# Altium project 28Pins_Project_V1I1.PrjPcb
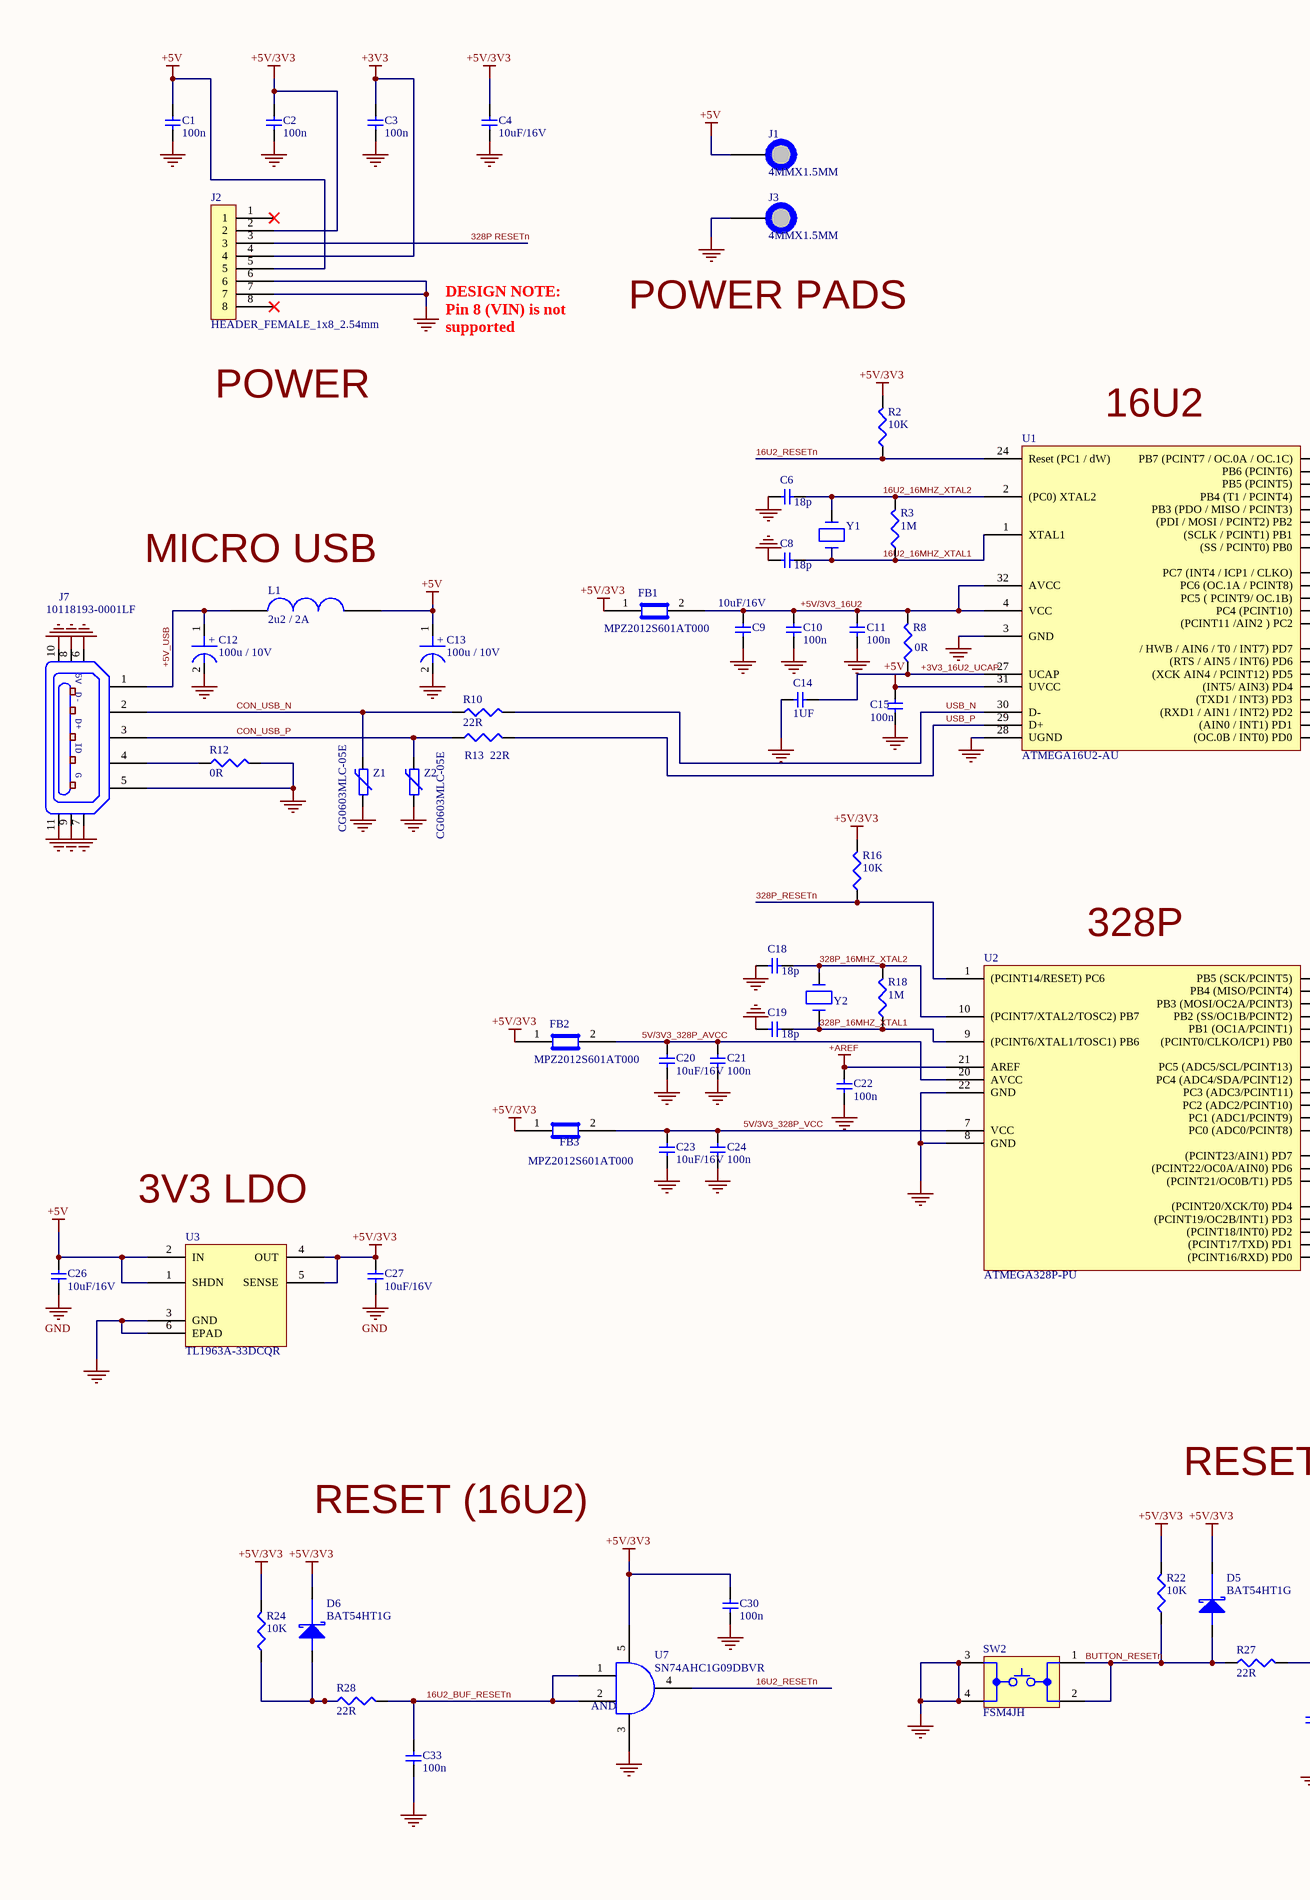
[diagram p0: 28Pins_Schematic.SchDoc, left]
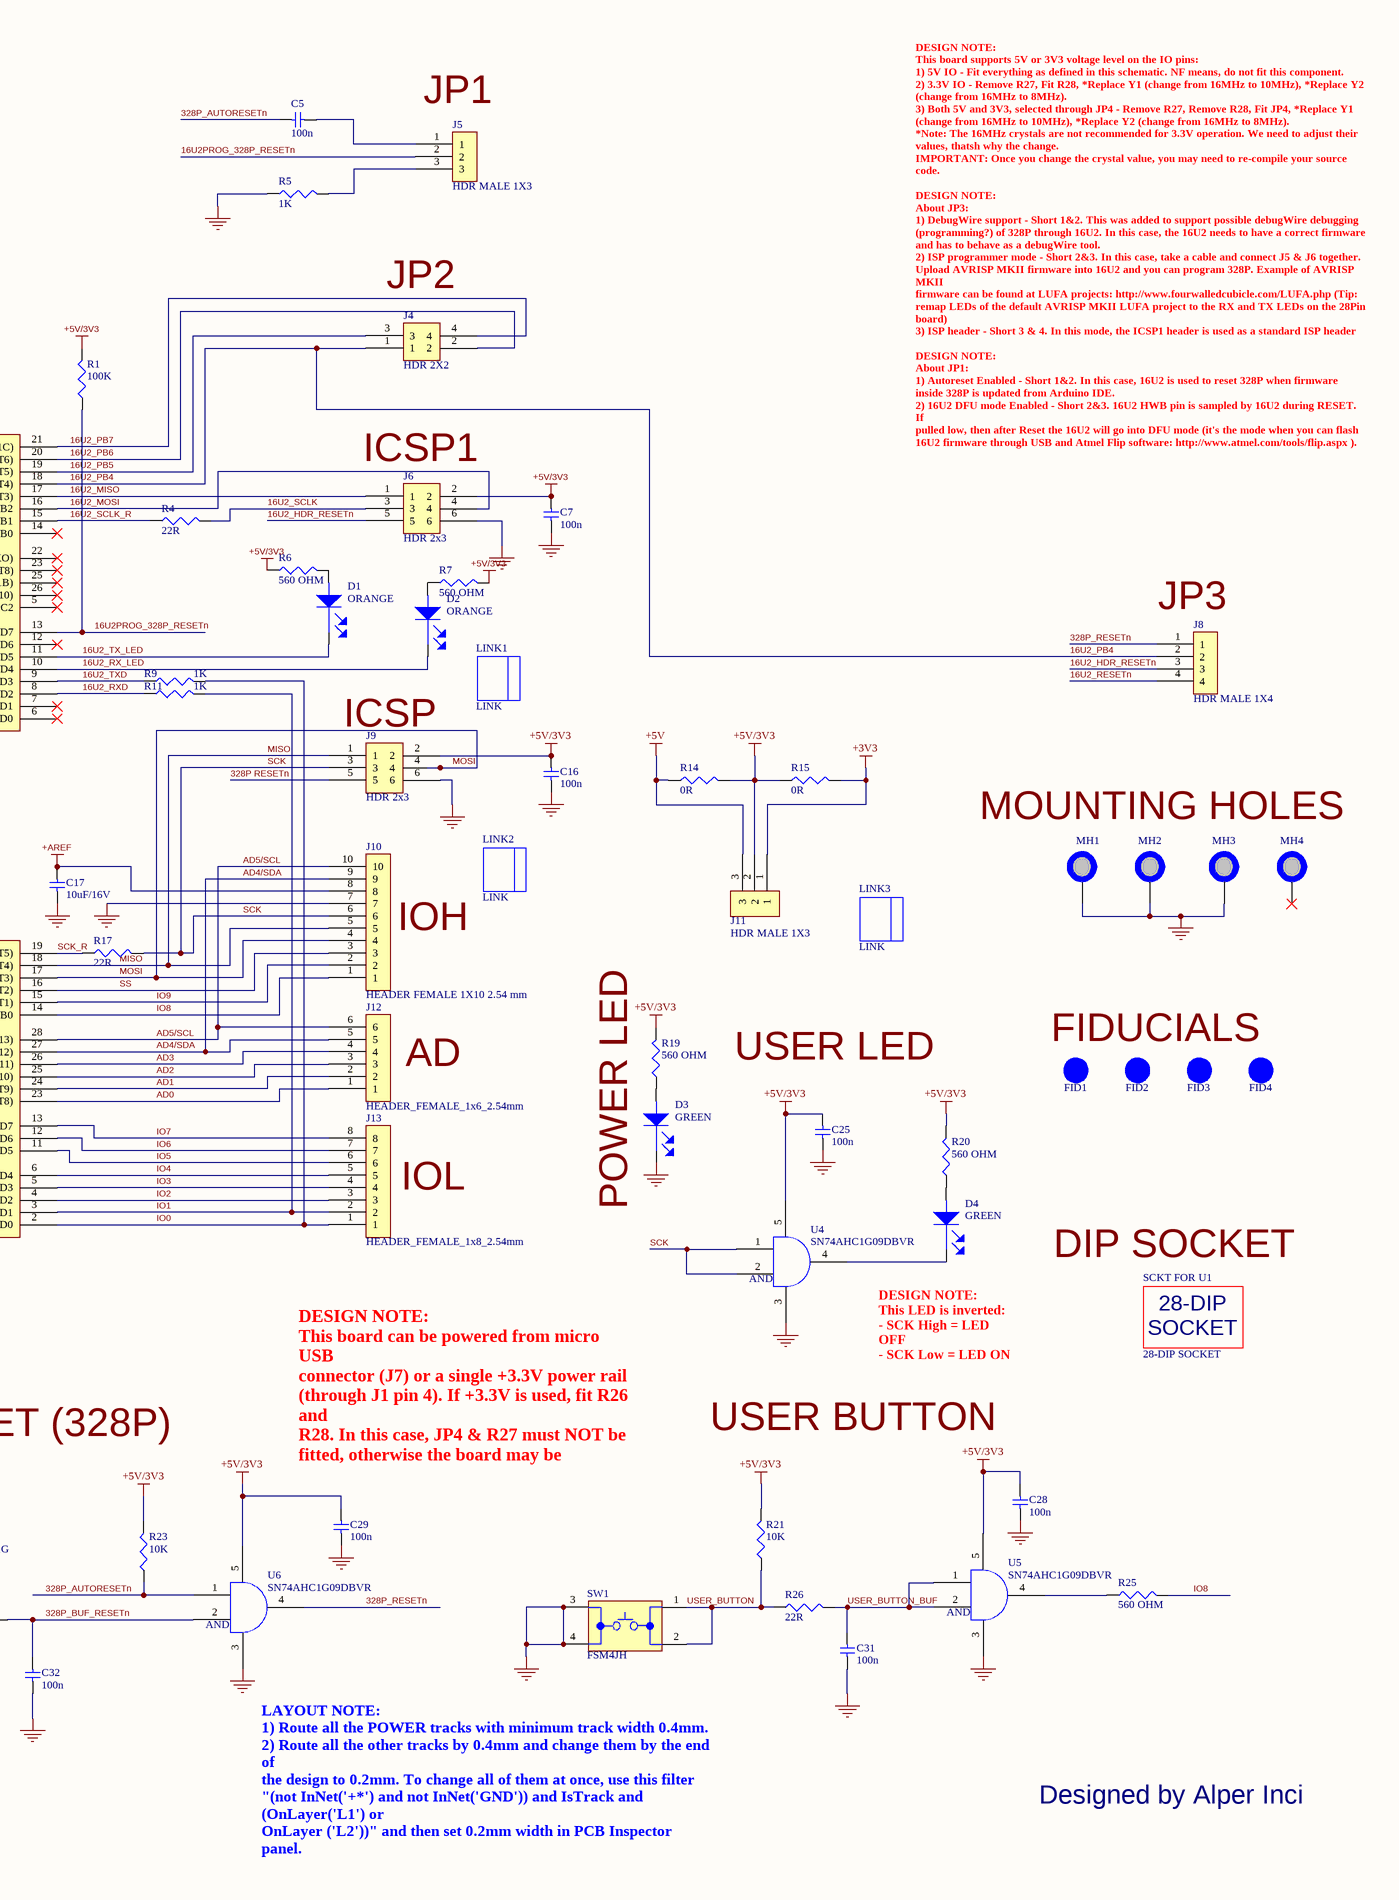
[diagram p1: 28Pins_Schematic.SchDoc, right]
NotFitted: NF
1 sheet, 109 parts. Net scope: global (net labels, ports and power ports of the same name join across sheets).
Board file: 28_Pins_Project_V1I1_PCB.PcbDoc

## Sheet 28Pins_Schematic.SchDoc
size A2

### Parts
C1  100n  [C0805]
C2  100n  [C0805]
C3  100n  [C0805]
C4  10uF/16V  [C0805_v2]
C5  100n  [C0805]
C6  18p  [C0805]
C7  100n  [C0805]
C8  18p  [C0805]
C9  10uF/16V  [C0805_v2]
C10  100n  [C0805]
C11  100n  [C0805]
C12  100u / 10V  [C_ALU_C_SIZE]
C13  100u / 10V  [C_ALU_C_SIZE]
C14  1UF  [C0805]
C15  100n  [C0805]
C16  100n  [C0805]
C17  10uF/16V  [C0805_v2]
C18  18p  [C0805]
C19  18p  [C0805]
C20  10uF/16V  [C0805_v2]
C21  100n  [C0805]
C22  100n  [C0805]
C23  10uF/16V  [C0805_v2]
C24  100n  [C0805]
C25  100n  [C0805]
C26  10uF/16V  [C0805_v2]
C27  10uF/16V  [C0805_v2]
C28  100n  [C0805]
C29  100n  [C0805]
C30  100n  [C0805]
C31  100n  [C0805]
C32  100n  [C0805]
C33  100n  [C0805]
D1  ORANGE  [LED_0603]
D2  ORANGE  [LED_0603]
D3  GREEN  [LED_0603]
D4  GREEN  [LED_0603]
D5  BAT54HT1G  [SOD323]
D6  BAT54HT1G  [SOD323]
FB1  MPZ2012S601AT000  [C0805]
FB2  MPZ2012S601AT000  [C0805]
FB3  MPZ2012S601AT000  [C0805]
FID1  FID 1MM  [FID_40X120D]  (value not drawn)  (no BOM)
FID2  FID 1MM  [FID_40X120D]  (value not drawn)  (no BOM)
FID3  FID 1MM  [FID_40X120D]  (value not drawn)  (no BOM)
FID4  FID 1MM  [FID_40X120D]  (value not drawn)  (no BOM)
J1  4MMX1.5MM  [PAD_WTIH_HOLE_4MMX1.5MM]  (no BOM)
J2  HEADER_FEMALE_1x8_2.54mm  [HEADER_FEMALE_1X8_2.54mm]
J3  4MMX1.5MM  [PAD_WTIH_HOLE_4MMX1.5MM]  (no BOM)
J4  HDR 2X2  [HDR_2X2_2.54mm]
J5  HDR MALE 1X3  [HEADER_MALE_1X3_2.54mm]
J6  HDR 2x3  [HDR_2X3_2.54mm]
J7  10118193-0001LF  [10118193]
J8  HDR MALE 1X4  [HEADER_MALE_1X4_2.54mm]
J9  HDR 2x3  [HDR_2X3_2.54mm]
J10  HEADER FEMALE 1X10 2.54 mm  [HEADER_FEMALE_1X10_2.54mm]
J11  HDR MALE 1X3  [HEADER_MALE_1X3_2.54mm]
J12  HEADER_FEMALE_1x6_2.54mm  [HEADER_FEMALE_1X6_2.54mm]
J13  HEADER_FEMALE_1x8_2.54mm  [HEADER_FEMALE_1X8_2.54mm]
L1  2u2 / 2A  [C1210_IND]
LINK1  LINK  (mechanical)
LINK2  LINK  (mechanical)
LINK3  LINK  (mechanical)
MH1  MH_7.4MMC_3.2MMD  [MH_7.4MMC_3.2MMD]  (value not drawn)  (no BOM)
MH2  MH_7.4MMC_3.2MMD  [MH_7.4MMC_3.2MMD]  (value not drawn)  (no BOM)
MH3  MH_7.4MMC_3.2MMD  [MH_7.4MMC_3.2MMD]  (value not drawn)  (no BOM)
MH4  MH_7.4MMNC_3.2MMD  [MH_7.4MMNC_3.2MMD_NON_COPPER_NPTH]  (value not drawn)  (no BOM)
R1  100K  [R0805]
R2  10K  [R0805]
R3  1M  [R0805]
R4  22R  [R0805]
R5  1K  [R0805]
R6  560 OHM  [R0805]
R7  560 OHM  [R0805]
R8  0R  [R0805]
R9  1K  [R0805]
R10  22R  [R0805]
R11  1K  [R0805]
R12  0R  [R0805]
R13  22R  [R0805]
R14  0R  [R0805]
R15  0R  [R0805]
R16  10K  [R0805]
R17  22R  [R0805]
R18  1M  [R0805]
R19  560 OHM  [R0805]
R20  560 OHM  [R0805]
R21  10K  [R0805]
R22  10K  [R0805]
R23  10K  [R0805]
R24  10K  [R0805]
R25  560 OHM  [R0805]
R26  22R  [R0805]
R27  22R  [R0805]
R28  22R  [R0805]
SCKT_FOR_U1  28-DIP SOCKET  [28_DIP_7.62MM_SOCKET]
SW1  FSM4JH  [FSM4JH]
SW2  FSM4JH  [FSM4JH]
U1  ATMEGA16U2-AU  [TQFP32]
U2  ATMEGA328P-PU  [28_DIP_7.62mm]
U3  TL1963A-33DCQR  [DCQ (R-PDSO-G6)]
U4  SN74AHC1G09DBVR  [DBV_SOT_23_5]
U5  SN74AHC1G09DBVR  [DBV_SOT_23_5]
U6  SN74AHC1G09DBVR  [DBV_SOT_23_5]
U7  SN74AHC1G09DBVR  [DBV_SOT_23_5]
Y1  ABM7-16.000MHZ-D2Y-T  [ABM_v1_1_BIG]  (value not drawn)
Y2  ABM7-16.000MHZ-D2Y-T  [ABM_v1_1_BIG]  (value not drawn)
Z1  CG0603MLC-05E  [R0603]
Z2  CG0603MLC-05E  [R0603]

### Nets
+3V3: C3.2 J2.4 J11.1 R15.2
+5V: C1.2 C13.1 C15.2 C26.2 J1.1 J2.5 J11.3 L1.4 U1.31(UVCC) U3.1(SHDN) U3.2(IN)
+5V/3V3: C2.2 C4.2 C7.2 C16.2 C25.2 C27.2 C28.2 C29.2 C30.2 D5.1(Cathode) D6.1(Cathode) FB1.1 FB2.1 FB3.1 J2.2 J6.2 J9.2 J11.2 R1.2 R2.2 R6.1 R7.2 R14.2 R16.2 R19.2 R20.2 R21.2 R22.2 R23.2 R24.2 U3.4(OUT) U3.5(SENSE) U4.5 U5.5 U6.5 U7.5
+AREF: C17.2 C22.2 J10.8 U2.21(AREF)
GND: C1.1 C2.1 C3.1 C4.1 C6.1 C7.1 C8.1 C9.1 C10.1 C11.1 C12.2 C13.2 C14.1 C15.1 C16.1 C17.1 C18.1 C19.1 C20.1 C21.1 C22.1 C23.1 C24.1 C25.1 C26.1 C27.1 C28.1 C29.1 C30.1 C31.1 C32.1 C33.1 D3.1(Cathode) J2.6 J2.7 J3.1 J6.6 J7.5 J7.6 J7.7 J7.8 J7.9 J7.10 J7.11 J9.6 J10.7 MH1.1 MH2.1 MH3.1 R5.1 R12.2 SW1.3 SW1.4 SW2.3 SW2.4 U1.3(GND) U1.28(UGND) U2.8(GND) U2.22(GND) U3.3(GND) U3.6(EPAD) U4.3 U5.3 U6.3 U7.3 Z1.1 Z2.1
5V/3V3_328P_AVCC: C20.2 C21.2 FB2.2 U2.20(AVCC)
5V/3V3_328P_VCC: C23.2 C24.2 FB3.2 U2.7(VCC)
16U2_16MHZ_XTAL1: C8.2 R3.1 U1.1(XTAL1) Y1.1
16U2_16MHZ_XTAL2: C6.2 R3.2 U1.2((PC0)_XTAL2)
16U2_BUF_RESETn: C33.2 R28.2 U7.1 U7.2
16U2_HDR_RESETn: J6.5 J8.3
16U2_MISO: J6.1 U1.17(PB3_(PDO_/_MISO_/_PCINT3))
16U2_MOSI: J6.4 U1.16((PDI_/_MOSI_/_PCINT2)_PB2)
16U2_PB4: J4.1 J8.2 U1.18(PB4_(T1_/_PCINT4))
16U2_PB5: J4.3 U1.19(PB5_(PCINT5))
16U2_PB6: J4.2 U1.20(PB6_(PCINT6))
16U2_PB7: J4.4 U1.21(PB7_(PCINT7_/_OC.0A_/_OC.1C))
16U2_RESETn: J8.4 R2.1 U1.24(Reset_(PC1_/_dW)) U7.4
16U2_RX_LED: D2.1(Cathode) U1.10((INT5/_AIN3)_PD4)
16U2_RXD: R11.1 U1.8((RXD1_/_AIN1_/_INT2)_PD2)
16U2_SCLK: J6.3 R4.2
16U2_SCLK_R: R4.2 U1.15((SCLK_/_PCINT1)_PB1)
16U2_TX_LED: D1.1(Cathode) U1.11((XCK_AIN4_/_PCINT12)_PD5)
16U2_TXD: R9.1 U1.9((TXD1_/_INT3)_PD3)
16U2PROG_328P_RESETn: J5.2 R1.1 U1.13(/_HWB_/_AIN6_/_T0_/_INT7)_PD7)
328P RESETn: J2.3 J9.5
328P_16MHZ_XTAL1: C19.2 R18.1 U2.9((PCINT6/XTAL1/TOSC1)_PB6)
328P_16MHZ_XTAL2: C18.2 R18.2 U2.10((PCINT7/XTAL2/TOSC2)_PB7)
328P_AUTORESETn: C5.1 R23.1 U6.1
328P_BUF_RESETn: C32.2 R27.2 U6.2
328P_RESETn: J8.1 R16.1 U2.1((PCINT14/RESET)_PC6) U6.4
+3V3_16U2_UCAP: C14.2 R8.2 U1.27(UCAP)
+5V/3V3_16U2: C9.2 C10.2 C11.2 FB1.2 R8.2 U1.4(VCC) U1.32(AVCC)
+5V_USB: C12.1 J7.1 L1.3
AD0: J12.1 U2.23(PC0_(ADC0/PCINT8))
AD1: J12.2 U2.24(PC1_(ADC1/PCINT9))
AD2: J12.3 U2.25(PC2_(ADC2/PCINT10))
AD3: J12.4 U2.26(PC3_(ADC3/PCINT11))
AD4/SDA: J10.9 J12.5 U2.27(PC4_(ADC4/SDA/PCINT12))
AD5/SCL: J10.10 J12.6 U2.28(PC5_(ADC5/SCL/PCINT13))
BUTTON_RESETn: D5.2(Anode) R22.1 R27.2 SW2.1 SW2.2
CON_USB_N: J7.2 R10.2 Z1.2
CON_USB_P: J7.3 R13.2 Z2.2
IO0: J13.1 R9.2 U2.2((PCINT16/RXD)_PD0)
IO1: J13.2 R11.2 U2.3((PCINT17/TXD)_PD1)
IO2: J13.3 U2.4((PCINT18/INT0)_PD2)
IO3: J13.4 U2.5((PCINT19/OC2B/INT1)_PD3)
IO4: J13.5 U2.6((PCINT20/XCK/T0)_PD4)
IO5: J13.6 U2.11((PCINT21/OC0B/T1)_PD5)
IO6: J13.7 U2.12((PCINT22/OC0A/AIN0)_PD6)
IO7: J13.8 U2.13((PCINT23/AIN1)_PD7)
IO8: J10.1 R25.2 U2.14((PCINT0/CLKO/ICP1)_PB0)
IO9: J10.2 U2.15(PB1_(OC1A/PCINT1))
MISO: J9.1 J10.5 U2.18(PB4_(MISO/PCINT4))
MOSI: J9.4 J10.4 U2.17(PB3_(MOSI/OC2A/PCINT3))
SCK: J9.3 J10.6 R17.2 U4.1 U4.2
SCK_R: R17.2 U2.19(PB5_(SCK/PCINT5))
SS: J10.3 U2.16(PB2_(SS/OC1B/PCINT2))
USB_N: R10.2 U1.30(D-)
USB_P: R13.2 U1.29(D+)
USER_BUTTON: R21.1 R26.2 SW1.1 SW1.2
USER_BUTTON_BUF: C31.2 R26.2 U5.1 U5.2
NetC5_2: C5.2 J5.1
NetD1_2: D1.2(Anode) R6.2
NetD2_2: D2.2(Anode) R7.1
NetD3_2: D3.2(Anode) R19.1
NetD4_1: D4.1(Cathode) U4.4
NetD4_2: D4.2(Anode) R20.1
NetD6_2: D6.2(Anode) R24.1 R28.2
NetJ5_3: J5.3 R5.2
NetJ7_4: J7.4 R12.2
NetR25_1: R25.1 U5.4

Not connected (* = marked no-connect by the designer): J2 1* 8*; MH4 1*; U1 5((PCINT11_/AIN2_)_PC2)* 6((OC.0B_/_INT0)_PD0)* 7((AIN0_/_INT1)_PD1)* 12((RTS_/_AIN5_/_INT6)_PD6)* 14((SS_/_PCINT0)_PB0)* 22(PC7_(INT4_/_ICP1_/_CLKO))* 23(PC6_(OC.1A_/_PCINT8))* 25(PC5_(_PCINT9/_OC.1B))* 26(PC4_(PCINT10))*; Y1 2; Y2 1 2

### Notes on the sheet
- (near J5) JP1
- DESIGN NOTE:
  Pin 8 (VIN) is not
  supported
- POWER PADS
- (near J4) JP2
- POWER
- (near U1) 16U2
- (near J6) ICSP1
- DESIGN NOTE:
  This board supports 5V or 3V3 voltage level on the IO pins:
  1) 5V IO - Fit everything as defined in this schematic. NF means, do not fit this component.
  2) 3.3V IO - Remove R27, Fit R28, *Replace Y1 (change from 16MHz to 10MHz), *Replace Y2
  (change from 16MHz to 8MHz).
  3) Both 5V and 3V3, selected through JP4 - Remove R27, Remove R28, Fit JP4, *Replace Y1
  (change from 16MHz to 10MHz), *Replace Y2 (change from 16MHz to 8MHz).
  *Note: The 16MHz crystals are not recommended for 3.3V operation. We need to adjust their
  values, thatsh why the change.
  IMPORTANT: Once you change the crystal value, you may need to re-compile your source
  code.
  DESIGN NOTE:
  About JP3:
  1) DebugWire support - Short 1&2. This was added to support possible debugWire debugging
  (programming?) of 328P through 16U2. In this case, the 16U2 needs to have a correct firmware
  and has to behave as a debugWire tool.
  2) ISP programmer mode - Short 2&3. In this case, take a cable and connect J5 & J6 together.
  Upload AVRISP MKII firmware into 16U2 and you can program 328P. Example of AVRISP MKII
  firmware can be found at LUFA projects: http://www.fourwalledcubicle.com/LUFA.php (Tip:
  remap LEDs of the default AVRISP MKII LUFA project to the RX and TX LEDs on the 28Pin
  board)
  3) ISP header - Short 3 & 4. In this mode, the ICSP1 header is used as a standard ISP header
  DESIGN NOTE:
  About JP1:
  1) Autoreset Enabled - Short 1&2. In this case, 16U2 is used to reset 328P when firmware
  inside 328P is updated from Arduino IDE.
  2) 16U2 DFU mode Enabled - Short 2&3. 16U2 HWB pin is sampled by 16U2 during RESET. If
  pulled low, then after Reset the 16U2 will go into DFU mode (it's the mode when you can flash
  16U2 firmware through USB and Atmel Flip software: http://www.atmel.com/tools/flip.aspx ).
- (near L1) MICRO USB
- (near J8) JP3
- (near J9) ICSP
- MOUNTING HOLES
- (near U2) 328P
- (near J10) IOH
- AD
- USER LED
- FIDUCIALS
- POWER LED
- (near U3) 3V3 LDO
- (near J13) IOL
- (near SCKT_FOR_U1) DIP SOCKET
- (near D4) DESIGN NOTE:
  This LED is inverted:
  - SCK High = LED
  OFF
  - SCK Low = LED ON
- RESET (328P)
- USER BUTTON
- RESET (16U2)
- DESIGN NOTE:
  This board can be powered from micro USB
  connector (J7) or a single +3.3V power rail
  (through J1 pin 4). If +3.3V is used, fit R26 and
  R28. In this case, JP4 & R27 must NOT be
  fitted, otherwise the board may be damaged.
- Designed by Alper Inci
- LAYOUT NOTE:
  1) Route all the POWER tracks with minimum track width 0.4mm.
  2) Route all the other tracks by 0.4mm and change them by the end of
  the design to 0.2mm. To change all of them at once, use this filter
  "(not InNet('+*') and not InNet('GND')) and IsTrack and (OnLayer('L1') or
  OnLayer ('L2'))" and then set 0.2mm width in PCB Inspector panel.
- (in symbol 4828-3004-CP) 28-DIP; SOCKET
- (in symbol 10118193-0001LF) 5V; D-; D+; ID; G
- (in symbol EEE-1AA101WR) +
- (in symbol SN74AHC1G09DBVR) AND

### Library data of the parts
C1-C3 C5 C7 C10 C11 C15 C16 C21 C22 C24 C25 C28-C33 = C2012X7R1H104K085AA: CAP CER 0.1UF 50V X7R 0805; Manufacturer: Mouser Electronics; Get more results: Please configure for MyMouser login credentials; Product Status: New Product; Supplier 1: Mouser; Manufacturer Part Number: C2012X7R1H104K085AA; RoHS: RoHS Compliant; Category: Daily Limit Reached; Stock 1: 0; Pricing 1: 1=0.00 (USD); Create Account URL: https://www.mouser.com/MyMouser/CreateAccount.aspx; Login URL: https://www.mouser.com/MyMouser/MouserLogin.aspx; Minimum Order Quantity: 1; Reeling: False; Supplier Part Number 1: C2012X7R1H104K085AA
C4 C9 C17 C20 C23 C26 C27 = C2012X5R1C106M125AC: CAP CER 10UF 16V X5R 0805; Manufacturer: Mouser Electronics; Get more results: Please configure for MyMouser login credentials; Product Status: New Product; Supplier 1: Mouser; Manufacturer Part Number: C2012X5R1C106M125AC; RoHS: RoHS Compliant; Category: Daily Limit Reached; Stock 1: 0; Pricing 1: 1=0.00 (USD); Create Account URL: https://www.mouser.com/MyMouser/CreateAccount.aspx; Login URL: https://www.mouser.com/MyMouser/MouserLogin.aspx; Minimum Order Quantity: 1; Reeling: False; Supplier Part Number 1: C2012X5R1C106M125AC
C6 C8 C18 C19 = C0805C180J5GACTU: CAP CER 18PF 50V NP0 0805; Manufacturer: KEMET; Supplier 1: Allied; Manufacturer Part Number: C0805C180J5GACTU; RoHS: No; Stock 1: 9520; Pricing 1: 10=0.0200 (USD); ComponentLink1URL: https://www.alliedelec.com/m/d/50b0791ef9828d4ace226f67180d8c1a.pdf; ComponentLink1Description: https://www.alliedelec.com/m/d/50b0791ef9828d4ace226f67180d8c1a.pdf; ComponentLink2URL: https://www.alliedelec.com/kemet-c0805c180j5gactu/70095583/; ComponentLink2Description: https://www.alliedelec.com/kemet-c0805c180j5gactu/70095583/; Supplier Part Number 1: 70095583
C12 C13 = EEE-1AA101WR: CAP ALUM 100UF 20% 10V SMD; Manufacturer: Panasonic; Supplier 1: Allied; Manufacturer Part Number: EEE-1AA101WR; RoHS: No; Stock 1: 0; Pricing 1: 3000=0.1540, 6000=0.1514, 15000=0.1466, 30000=0.1400, 75000=0.1305, 150000=0.1202, 300000=0.1078 (USD); ComponentLink1URL: https://www.alliedelec.com/m/d/310b2cfd0553a89b5ffae819c6e32d0a.pdf; ComponentLink1Description: https://www.alliedelec.com/m/d/310b2cfd0553a89b5ffae819c6e32d0a.pdf; ComponentLink2URL: https://www.alliedelec.com/panasonic-eee-1aa101wr/70256240/; ComponentLink2Description: https://www.alliedelec.com/panasonic-eee-1aa101wr/70256240/; Supplier Part Number 1: 70256240
C14 = C2012X5R1E105K125AA: CAP CER 10UF 16V X5R 0805; Manufacturer: Mouser Electronics; Get more results: Please configure for MyMouser login credentials; Product Status: New Product; Supplier 1: Mouser; Manufacturer Part Number: C2012X5R1E105K125AA; RoHS: RoHS Compliant; Category: Daily Limit Reached; Stock 1: 0; Pricing 1: 1=0.00 (USD); Create Account URL: https://www.mouser.com/MyMouser/CreateAccount.aspx; Login URL: https://www.mouser.com/MyMouser/MouserLogin.aspx; Minimum Order Quantity: 1; Reeling: False; Supplier Part Number 1: Anonymous Daily Limit Reached
D1 D2 = LO L29K-H2K1-24-Z: LED ORANGE DIFFUSED 0603 SMD; Manufacturer: Carling Technologies; Supplier 1: Allied; Manufacturer Part Number: LO L29K-H2K1-24-Z; RoHS: No; Stock 1: 0; Pricing 1: 25=3.0900 (USD); ComponentLink2URL: https://www.alliedelec.com/carling-technologies-lra911-cr-b-250n-hi-lo/71572183/; ComponentLink2Description: https://www.alliedelec.com/carling-technologies-lra911-cr-b-250n-hi-lo/71572183/; Supplier Part Number 1: 71572183
D3 D4 = LG L29K-G2J1-24-Z: LED GREEN DIFFUSED 0603 SMD; Manufacturer: Osram Opto Semiconductors; Supplier 1: Allied; Manufacturer Part Number: LG L29K-G2J1-24-Z; RoHS: No; Stock 1: 32107; Pricing 1: 1=0.0505 (USD); ComponentLink1URL: https://www.alliedelec.com/m/d/d19aa5c5274efe304f2af274a0ac8334.pdf; ComponentLink1Description: https://www.alliedelec.com/m/d/d19aa5c5274efe304f2af274a0ac8334.pdf; ComponentLink2URL: https://www.alliedelec.com/osram-opto-semiconductors-lg-r971/70338572/; ComponentLink2Description: https://www.alliedelec.com/osram-opto-semiconductors-lg-r971/70338572/; Supplier Part Number 1: 70338572
D5 D6 = BAT54HT1G: DIODE SCHOTTKY 30V 200MA SOD323; Manufacturer: ON Semiconductor; Supplier 1: Allied; Manufacturer Part Number: BAT54HT1G; RoHS: No; Stock 1: 1580; Pricing 1: 10=0.0946, 100=0.0936, 250=0.0927 (USD); ComponentLink1URL: https://www.alliedelec.com/m/d/32ed7fc37a0b4f97ae8b34bd526f7e4f.pdf; ComponentLink1Description: https://www.alliedelec.com/m/d/32ed7fc37a0b4f97ae8b34bd526f7e4f.pdf; ComponentLink2URL: https://www.alliedelec.com/onsemiconductor-bat54ht1g/70099482/; ComponentLink2Description: https://www.alliedelec.com/onsemiconductor-bat54ht1g/70099482/; Supplier Part Number 1: 70099482
FB1-FB3 = MPZ2012S601AT000: FERRITE CHIP BEAD  600 OHM SMD; Manufacturer: Mouser Electronics; Get more results: Please configure for MyMouser login credentials; Product Status: New Product; Supplier 1: Mouser; Manufacturer Part Number: MPZ2012S601AT000; RoHS: RoHS Compliant; Category: Daily Limit Reached; Stock 1: 0; Pricing 1: 1=0.00 (USD); Create Account URL: https://www.mouser.com/MyMouser/CreateAccount.aspx; Login URL: https://www.mouser.com/MyMouser/MouserLogin.aspx; Minimum Order Quantity: 1; Reeling: False; Supplier Part Number 1: Anonymous Daily Limit Reached
FID1-FID4 = FID_1MMC: FIDUCIAL 40MIL DIAMETER,120 MIL MASK
J1 J3 = PAD_WITH_HOLE_4MMX1.5MM: PAD WITH A HOLE
J2 J13 = M20-7820842: HARWIN 2.54mm 8 Way 1 Row Straight PCBSocket Through Hole Socket Strip; Manufacturer: Mouser Electronics; Get more results: Please configure for MyMouser login credentials; Product Status: New Product; Supplier 1: Mouser; Manufacturer Part Number: M20-7820842; RoHS: RoHS Compliant; Category: Daily Limit Reached; Stock 1: 0; Pricing 1: 1=0.00 (USD); Create Account URL: https://www.mouser.com/MyMouser/CreateAccount.aspx; Login URL: https://www.mouser.com/MyMouser/MouserLogin.aspx; Minimum Order Quantity: 1; Reeling: False; Supplier Part Number 1: M20-7820842
J4 = 68602-204HLF: CONN HEADER 4POS .100 STR 30AU; Manufacturer: Mouser Electronics; Get more results: Please configure for MyMouser login credentials; Product Status: New Product; Supplier 1: Mouser; Manufacturer Part Number: 68602-204HLF; RoHS: RoHS Compliant; Category: Daily Limit Reached; Stock 1: 0; Pricing 1: 1=0.00 (USD); Create Account URL: https://www.mouser.com/MyMouser/CreateAccount.aspx; Login URL: https://www.mouser.com/MyMouser/MouserLogin.aspx; Minimum Order Quantity: 1; Reeling: False; Supplier Part Number 1: 68602-204HLF
J5 J11 = 68000-103HLF: HDR MALE 1X3 2.54 MM; Manufacturer: Amphenol ICC; Supplier 1: Allied; Manufacturer Part Number: 68000-103HLF; RoHS: No; Stock 1: 1189; Pricing 1: 1=0.2145, 25=0.2059, 100=0.1887, 250=0.1630, 500=0.1544 (USD); ComponentLink1URL: https://www.alliedelec.com/m/d/db594e6708c9daaed0ce5cfb84ef346f.pdf; ComponentLink1Description: https://www.alliedelec.com/m/d/db594e6708c9daaed0ce5cfb84ef346f.pdf; ComponentLink2URL: https://www.alliedelec.com/amphenolicc-68000-103hlf/70236888/; ComponentLink2Description: https://www.alliedelec.com/amphenolicc-68000-103hlf/70236888/; Supplier Part Number 1: 70236888
J6 J9 = 67997-106HLF: CONN HEADER 6POS .100 STR 30AU; Manufacturer: Amphenol ICC; Supplier 1: Allied; Manufacturer Part Number: 67997-106HLF; RoHS: No; Stock 1: 0; Pricing 1: 800=1.3500 (USD); ComponentLink1URL: https://www.alliedelec.com/m/d/75ed0fe4ed9dd5bdc045f1ca7ef961cc.pdf; ComponentLink1Description: https://www.alliedelec.com/m/d/75ed0fe4ed9dd5bdc045f1ca7ef961cc.pdf; ComponentLink2URL: https://www.alliedelec.com/amphenolicc-67997-106hlf/70302482/; ComponentLink2Description: https://www.alliedelec.com/amphenolicc-67997-106hlf/70302482/; Supplier Part Number 1: 70302482
J7 = 10118193-0001LF: CONN USB MICRO B RECPT SMT R/A; Manufacturer: Amphenol ICC; Supplier 1: Allied; Manufacturer Part Number: 10118193-0001LF; RoHS: No; Stock 1: 6740; Pricing 1: 1=0.2919, 25=0.2747, 100=0.2661, 250=0.2318, 500=0.2276 (USD); ComponentLink1URL: https://www.alliedelec.com/m/d/e03afc8e486ea55a2b0205fb8203b916.pdf; ComponentLink1Description: https://www.alliedelec.com/m/d/e03afc8e486ea55a2b0205fb8203b916.pdf; ComponentLink2URL: https://www.alliedelec.com/amphenolicc-10118193-0001lf/70236827/; ComponentLink2Description: https://www.alliedelec.com/amphenolicc-10118193-0001lf/70236827/; Supplier Part Number 1: 70236827
J8 = 68001-204HLF: HDR MALE 1X4 2.54MM; Manufacturer: Amphenol ICC; Supplier 1: Allied; Manufacturer Part Number: 68001-204HLF; RoHS: No; Stock 1: 0; Pricing 1: 12000=0.1787 (USD); ComponentLink1URL: https://www.alliedelec.com/m/d/f5d2b9d9c64cb957e21544e1dea10e7d.pdf; ComponentLink1Description: https://www.alliedelec.com/m/d/f5d2b9d9c64cb957e21544e1dea10e7d.pdf; ComponentLink2URL: https://www.alliedelec.com/amphenolicc-68001-204hlf/70302499/; ComponentLink2Description: https://www.alliedelec.com/amphenolicc-68001-204hlf/70302499/; Supplier Part Number 1: 70302499
J10 = M20-7821046: HARWIN 2.54mm 10 Way 1 Row Straight PCBSocket Through Hole Socket Strip; Supplier 1: Allied; Manufacturer Part Number: M20-7821046; RoHS: No; Stock 1: 1500; Pricing 1: 1=1.9400 (USD); ComponentLink1URL: https://www.alliedelec.com/m/d/01be0311a6eb419d8543d8d568eced2e.pdf; ComponentLink1Description: https://www.alliedelec.com/m/d/01be0311a6eb419d8543d8d568eced2e.pdf; ComponentLink2URL: https://www.alliedelec.com/-m20-7821046/70323442/; ComponentLink2Description: https://www.alliedelec.com/-m20-7821046/70323442/; Supplier Part Number 1: 70323442
J12 = M20-7820646: HARWIN 2.54mm 6 Way 1 Row Straight PCBSocket Through Hole Socket Strip; Manufacturer: Mouser Electronics; Get more results: Please configure for MyMouser login credentials; Product Status: New Product; Supplier 1: Mouser; Manufacturer Part Number: M20-7820646; RoHS: RoHS Compliant; Category: Daily Limit Reached; Stock 1: 0; Pricing 1: 1=0.00 (USD); Create Account URL: https://www.mouser.com/MyMouser/CreateAccount.aspx; Login URL: https://www.mouser.com/MyMouser/MouserLogin.aspx; Minimum Order Quantity: 1; Reeling: False; Supplier Part Number 1: M20-7820646
L1 = L1210R2R2MDWIT: FIXED IND 2.2UH 2A 80MOHM SMD; Manufacturer: Mouser Electronics; Get more results: Please configure for MyMouser login credentials; Product Status: New Product; Supplier 1: Mouser; Manufacturer Part Number: L1210R2R2MDWIT; RoHS: RoHS Compliant; Category: Daily Limit Reached; Stock 1: 0; Pricing 1: 1=0.00 (USD); Create Account URL: https://www.mouser.com/MyMouser/CreateAccount.aspx; Login URL: https://www.mouser.com/MyMouser/MouserLogin.aspx; Minimum Order Quantity: 1; Reeling: False; Supplier Part Number 1: Anonymous Daily Limit Reached
LINK1-LINK3 = QPC02SXGN-RC: Manufacturer: Mouser Electronics; Get more results: Please configure for MyMouser login credentials; Product Status: New Product; Supplier 1: Mouser; Manufacturer Part Number: QPC02SXGN-RC; RoHS: RoHS Compliant; Category: Daily Limit Reached; Stock 1: 0; Pricing 1: 1=0.00 (USD); Create Account URL: https://www.mouser.com/MyMouser/CreateAccount.aspx; Login URL: https://www.mouser.com/MyMouser/MouserLogin.aspx; Minimum Order Quantity: 1; Reeling: False; Supplier Part Number 1: Anonymous Daily Limit Reached
MH1-MH3 = MH_7.4MMC_3.2MMD: MOUNTING HOLE 7.4MM DIAMETER,3.2MM DRILL
MH4 = MH_7.4MMNC_3.2MMD: HOLE 7.4MM DIAMETER (NON COPPER), 3.2MM DRILL NPTH
R1 = RC0805FR-07100KL: RES SMD 100K OHM 1% 1/8W 0805; Manufacturer: Mouser Electronics; Get more results: Please configure for MyMouser login credentials; Product Status: New Product; Supplier 1: Mouser; Manufacturer Part Number: RC0805FR-07100KL; RoHS: RoHS Compliant; Category: Daily Limit Reached; Stock 1: 0; Pricing 1: 1=0.00 (USD); Create Account URL: https://www.mouser.com/MyMouser/CreateAccount.aspx; Login URL: https://www.mouser.com/MyMouser/MouserLogin.aspx; Minimum Order Quantity: 1; Reeling: False; Supplier Part Number 1: Anonymous Daily Limit Reached
R2 R16 R21-R24 = RC0805FR-0710KL: RES SMD 10K OHM 1/8 W 0805; Manufacturer: Mouser Electronics; Get more results: Please configure for MyMouser login credentials; Product Status: New Product; Supplier 1: Mouser; Manufacturer Part Number: RC0805FR-0710KL; RoHS: RoHS Compliant; Category: Daily Limit Reached; Stock 1: 0; Pricing 1: 1=0.00 (USD); Create Account URL: https://www.mouser.com/MyMouser/CreateAccount.aspx; Login URL: https://www.mouser.com/MyMouser/MouserLogin.aspx; Minimum Order Quantity: 1; Reeling: False; Supplier Part Number 1: RC0805FR-0710KL
R3 R18 = RC0805FR-071ML: RES SMD 1M OHM 1% 1/8W 0805; Manufacturer: Mouser Electronics; Get more results: Please configure for MyMouser login credentials; Product Status: New Product; Supplier 1: Mouser; Manufacturer Part Number: RC0805FR-071ML; RoHS: RoHS Compliant; Category: Daily Limit Reached; Stock 1: 0; Pricing 1: 1=0.00 (USD); Create Account URL: https://www.mouser.com/MyMouser/CreateAccount.aspx; Login URL: https://www.mouser.com/MyMouser/MouserLogin.aspx; Minimum Order Quantity: 1; Reeling: False; Supplier Part Number 1: RC0805FR-071ML
R4 R10 R13 R17 R26-R28 = RC0805FR-0722RL: RES SMD 22 OHM 1% 1/8W 0805; Manufacturer: Mouser Electronics; Get more results: Please configure for MyMouser login credentials; Product Status: New Product; Supplier 1: Mouser; Manufacturer Part Number: RC0805FR-0722RL; RoHS: RoHS Compliant; Category: Daily Limit Reached; Stock 1: 0; Pricing 1: 1=0.00 (USD); Create Account URL: https://www.mouser.com/MyMouser/CreateAccount.aspx; Login URL: https://www.mouser.com/MyMouser/MouserLogin.aspx; Minimum Order Quantity: 1; Reeling: False; Supplier Part Number 1: RC0805FR-0722RL
R5 R9 R11 = RC0805FR-071KL: RES SMD 1K OHM 1% 1/8W 0805; Manufacturer: Mouser Electronics; Get more results: Please configure for MyMouser login credentials; Product Status: New Product; Supplier 1: Mouser; Manufacturer Part Number: RC0805FR-071KL; RoHS: RoHS Compliant; Category: Daily Limit Reached; Stock 1: 0; Pricing 1: 1=0.00 (USD); Create Account URL: https://www.mouser.com/MyMouser/CreateAccount.aspx; Login URL: https://www.mouser.com/MyMouser/MouserLogin.aspx; Minimum Order Quantity: 1; Reeling: False; Supplier Part Number 1: RC0805FR-071KL
R6 R7 R19 R20 R25 = RC0805FR-07560RL: RES SMD 560 OHM 1% 1/8W 0805; Manufacturer: Mouser Electronics; Get more results: Please configure for MyMouser login credentials; Product Status: New Product; Supplier 1: Mouser; Manufacturer Part Number: RC0805FR-07560RL; RoHS: RoHS Compliant; Category: Daily Limit Reached; Stock 1: 0; Pricing 1: 1=0.00 (USD); Create Account URL: https://www.mouser.com/MyMouser/CreateAccount.aspx; Login URL: https://www.mouser.com/MyMouser/MouserLogin.aspx; Minimum Order Quantity: 1; Reeling: False; Supplier Part Number 1: Anonymous Daily Limit Reached
R8 R12 R14 R15 = RC0805JR-070RL: RES SMD 0 OHM 1% 1/8W 0805; Manufacturer: Mouser Electronics; Get more results: Please configure for MyMouser login credentials; Product Status: New Product; Supplier 1: Mouser; Manufacturer Part Number: RC0805JR-070RL; RoHS: RoHS Compliant; Category: Daily Limit Reached; Stock 1: 0; Pricing 1: 1=0.00 (USD); Create Account URL: https://www.mouser.com/MyMouser/CreateAccount.aspx; Login URL: https://www.mouser.com/MyMouser/MouserLogin.aspx; Minimum Order Quantity: 1; Reeling: False; Supplier Part Number 1: Anonymous Daily Limit Reached
SCKT_FOR_U1 = 4828-3004-CP: CONN IC  DIP SOCKET 28POS TIN; Manufacturer: 3M; Supplier 1: Allied; Manufacturer Part Number: 4828-3004-CP; RoHS: No; Stock 1: 1042; Pricing 1: 1=0.5927, 50=0.5711, 100=0.5388, 250=0.5065, 500=0.4634, 1000=0.4095 (USD); ComponentLink1URL: https://www.alliedelec.com/m/d/c6a66f3a2a97a8d8cac78de04d6de5d3.pdf; ComponentLink1Description: https://www.alliedelec.com/m/d/c6a66f3a2a97a8d8cac78de04d6de5d3.pdf; ComponentLink2URL: https://www.alliedelec.com/3m-4828-3004-cp/70237692/; ComponentLink2Description: https://www.alliedelec.com/3m-4828-3004-cp/70237692/; Supplier Part Number 1: 70237692
SW1 SW2 = FSM4JH: Alcoswitch, Switch,Pushbutton,Tactile,SPST,50mA,Thru Hole,6mm; Manufacturer: TE Connectivity; Supplier 1: Allied; Manufacturer Part Number: FSM4JH; RoHS: No; Stock 1: 0; Pricing 1: 750=0.1046 (USD); ComponentLink1URL: https://www.alliedelec.com/m/d/eaa16fe89a3a8acf140f751379b52364.pdf; ComponentLink1Description: https://www.alliedelec.com/m/d/eaa16fe89a3a8acf140f751379b52364.pdf; ComponentLink2URL: https://www.alliedelec.com/te-connectivity-fsm4jh/70156212/; ComponentLink2Description: https://www.alliedelec.com/te-connectivity-fsm4jh/70156212/; Supplier Part Number 1: 70156212
U1 = ATMEGA16U2-AU: Manufacturer: Mouser Electronics; Get more results: Please configure for MyMouser login credentials; Product Status: New Product; Supplier 1: Mouser; Manufacturer Part Number: ATMEGA16U2-AU; RoHS: RoHS Compliant; Category: Daily Limit Reached; Stock 1: 0; Pricing 1: 1=0.00 (USD); Create Account URL: https://www.mouser.com/MyMouser/CreateAccount.aspx; Login URL: https://www.mouser.com/MyMouser/MouserLogin.aspx; Minimum Order Quantity: 1; Reeling: False; Supplier Part Number 1: ATMEGA16U2-AU
U2 = ATMEGA328P-PU: ATMEGA328P-PU; 8 bit Microcontroller AVR 20MHz 1; 32kb Flash; 2kb RAM; I2C SPI 2; Manufacturer: Microchip Technology Inc.; Supplier 1: Allied; RoHS: No; Stock 1: 0; Pricing 1: 1=5.1200, 5=4.6100, 10=4.1800, 25=3.8300, 100=3.5500 (USD); ComponentLink1URL: https://www.alliedelec.com/m/d/768ce6a229d36838fb8bd4dcb29bd26e.pdf; ComponentLink1Description: https://www.alliedelec.com/m/d/768ce6a229d36838fb8bd4dcb29bd26e.pdf; ComponentLink2URL: https://www.alliedelec.com/microchiptechnologyinc-atmega328p-pu/70332157/; ComponentLink2Description: https://www.alliedelec.com/microchiptechnologyinc-atmega328p-pu/70332157/; Supplier Part Number 1: 70332157; Manufacturer Part Number: ATMEGA328P-PU
U3 = TL1963A-33DCQR: IC REG LDO 3.3V 1.5A SOT223-6; Manufacturer: Mouser Electronics; Get more results: Please configure for MyMouser login credentials; Product Status: New Product; Supplier 1: Mouser; Manufacturer Part Number: TL1963A-33DCQR; RoHS: RoHS Compliant; Category: Daily Limit Reached; Stock 1: 0; Pricing 1: 1=0.00 (USD); Create Account URL: https://www.mouser.com/MyMouser/CreateAccount.aspx; Login URL: https://www.mouser.com/MyMouser/MouserLogin.aspx; Minimum Order Quantity: 1; Reeling: False; Supplier Part Number 1: TL1963A-33DCQR
U4-U7 = SN74AHC1G09DBVR: IC GATE AND 1 CH 2-INP SOT-23-5; Manufacturer: Mouser Electronics; Get more results: Please configure for MyMouser login credentials; Product Status: New Product; Supplier 1: Mouser; Manufacturer Part Number: SN74AHC1G09DBVR; RoHS: RoHS Compliant; Category: Daily Limit Reached; Stock 1: 0; Pricing 1: 1=0.00 (USD); Create Account URL: https://www.mouser.com/MyMouser/CreateAccount.aspx; Login URL: https://www.mouser.com/MyMouser/MouserLogin.aspx; Minimum Order Quantity: 1; Reeling: False; Supplier Part Number 1: SN74AHC1G09DBVR
Y1 Y2 = ABM7-16.000MHZ-D2Y-T: Crystal; Ceramic; 16.000MHZ; 18pf; 20ppm @ 25C; 30ppm -40+85C; 6.0 x 3.5 x 1.2mm; T/R; Manufacturer: Abracon; Supplier 1: Allied; Manufacturer Part Number: ABM7-16.000MHZ-D2Y-T; RoHS: No; Stock 1: 0; Pricing 1: 1000=0.5800 (USD); ComponentLink1URL: https://www.alliedelec.com; ComponentLink1Description: https://www.alliedelec.com; ComponentLink2URL: https://www.alliedelec.com/abracon-abm7-16-000mhz-d2y-t/71528095/; ComponentLink2Description: https://www.alliedelec.com/abracon-abm7-16-000mhz-d2y-t/71528095/; Supplier Part Number 1: 71528095
Z1 Z2 = CG0603MLC-05E: VARISTOR 0603; Manufacturer: Bourns; Supplier 1: Allied; Manufacturer Part Number: CG0603MLC-05E; RoHS: No; Stock 1: 7999; Pricing 1: 1=0.1100, 1250=0.1067, 2500=0.1012, 12500=0.0946, 25000=0.0869, 125000=0.0682 (USD); ComponentLink1URL: https://www.alliedelec.com/m/d/c74d21cd372fe06fa9c5b8b4ec8a7246.pdf; ComponentLink1Description: https://www.alliedelec.com/m/d/c74d21cd372fe06fa9c5b8b4ec8a7246.pdf; ComponentLink2URL: https://www.alliedelec.com/bourns-cg0603mlc-05e/70153503/; ComponentLink2Description: https://www.alliedelec.com/bourns-cg0603mlc-05e/70153503/; Supplier Part Number 1: 70153503